# EasyEDA Pro project ProPrj_MBC5 电池 (ldo)定稿_2024-09-28.epro, board PCB4
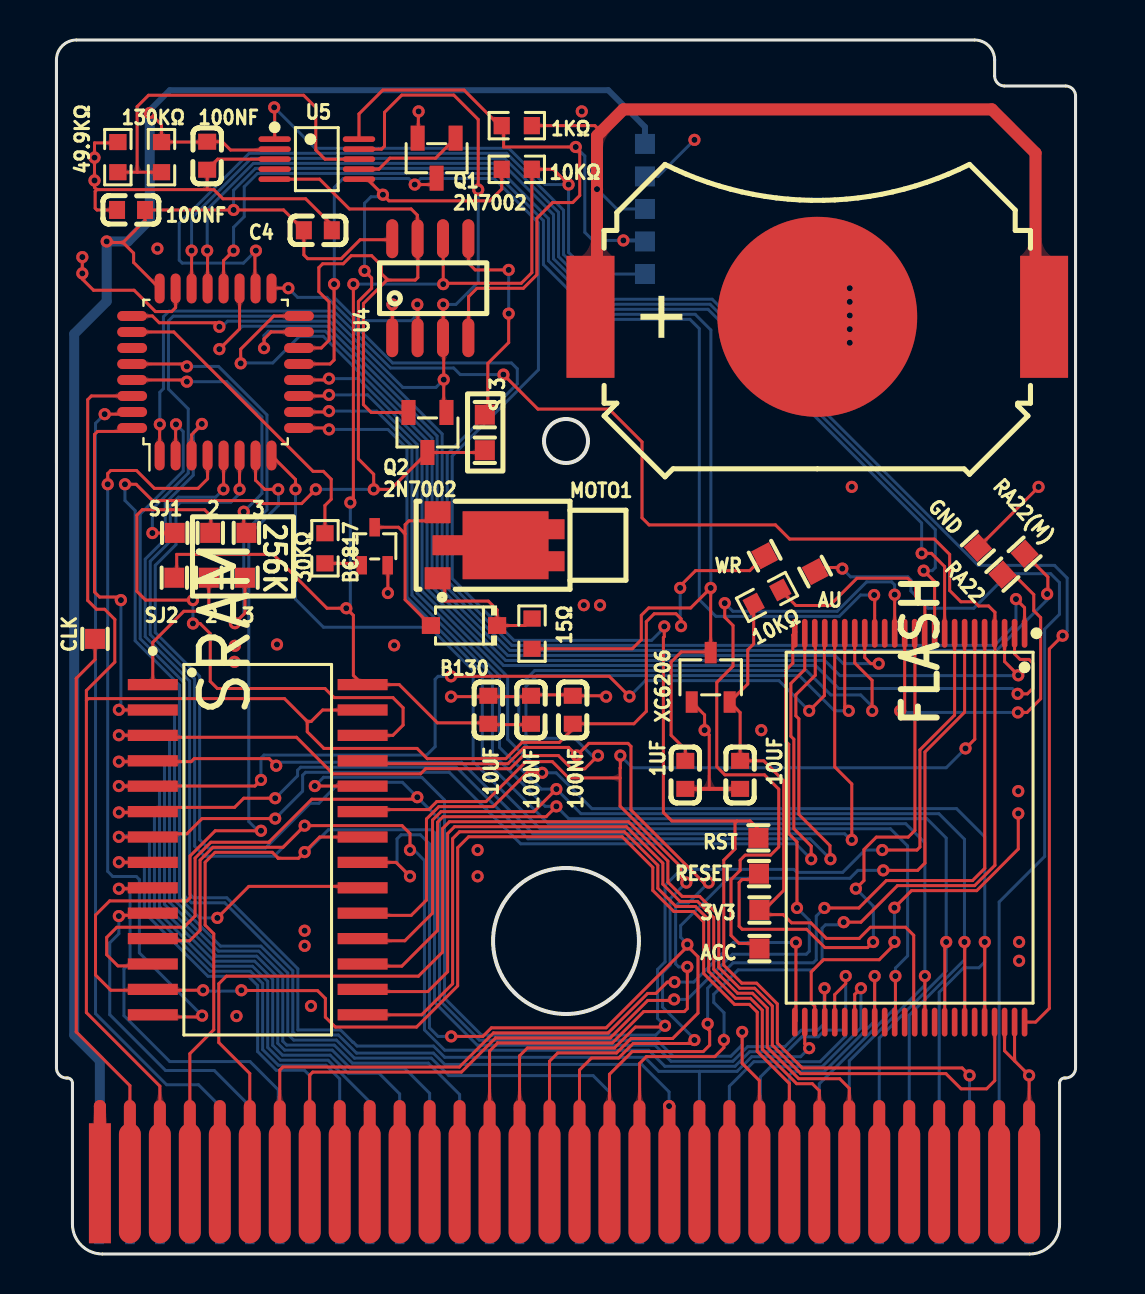
[diagram p1: board, top side]
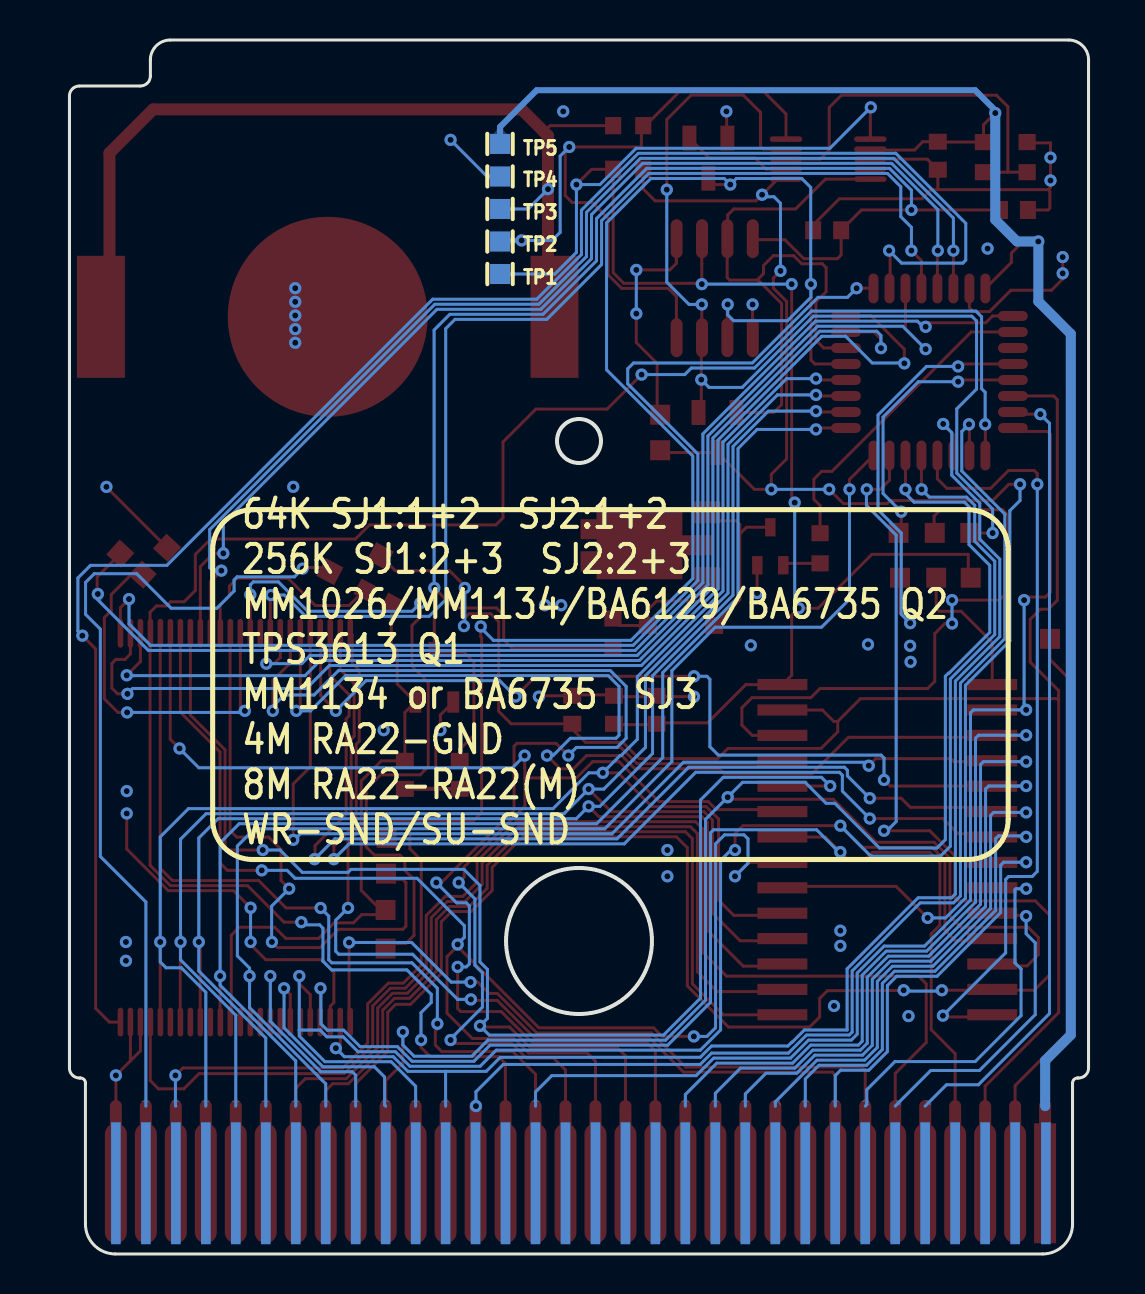
[diagram p2: board, bottom side, seen from below]

Outline 51 x 60.7 mm; copper layers: Top Layer, Bottom Layer. Coordinates in mm from the lower left corner of the outline.
Outline path: circle c25.5,40.65 r1.1 ; circle c25.5,15.65 r3.65 ; 0,59.7 0,9.3 arc(0.15,8.95) 0.5,8.8 0.55,8.8 arc(0.73,8.73) 0.8,8.55 0.8,1.5 arc(1.24,0.44) 2.3,0 48.7,0 arc(49.76,0.44) 50.2,1.5 50.2,8.55 arc(50.27,8.73) 50.45,8.8 50.5,8.8 arc(50.85,8.95) 51,9.3 51,57.9 arc(50.85,58.25) 50.5,58.4 47.45,58.4 arc(47.1,58.55) 46.95,58.9 46.95,59.7 arc(46.66,60.41) 45.95,60.7 1,60.7 arc(0.29,60.41) 0,59.7
Stack: Top Layer 0.035mm / Dielectric1 1.51mm FR4 er 4.5 / Bottom Layer 0.035mm

## Design rules (mm)
template: JLCPCB Capability(Two Layers Board)
spacing copperThickness1oz (default): track to track 0.102, other pairs 0.152 to 0.3
spacing copperThickness2oz: track to track 0.203, other pairs 0.152 to 0.3
track width copperThickness1oz (default): min 0.127, default 0.254, max 2.54
track width copperThickness2oz: min 0.203, default 0.254, max 2.54
differential pair differentialPair (default): width min 0.127, default 0.254, max 2.54; gap min 0.152, default 0.152
via viaSize (default): diameter min 0.5, default 0.61, max 10; hole min 0.3, default 0.305, max 6.3

## Placement (name value [footprint] x y rotation side)
1KΩ  -  [R0603]  23.04 56.42 0 top
1UF  -  [C0603]  31.47 23.96 90 top
2  -  [test_1p]  7.7 36.06 0 top
2#2  -  [test_1p]  7.63 33.81 0 top
3  -  [test_1p]  9.51 36.06 0 top
3#2  -  [test_1p]  9.44 33.81 0 top
3V3  RTC_VOUT  [test_1p]  35.18 17.2 270 top
10KΩ  -  [R0603]  35.56 32.85 207.8 top
10KΩ#2  -  [R0603]  23.04 54.23 0 top
10UF  -  [C0603]  21.62 27.21 90 top
10UF#2  -  [C0603]  34.21 23.96 90 top
15Ω  -  [R0603]  23.8 31.02 270 top
30KΩ  -  [R0603]  13.44 35.29 90 top
49.9KΩ  -  [R0603]  3.07 54.84 90 top
100NF  -  [C0603]  25.84 27.21 90 top
100NF#2  -  [C0603]  3.73 52.2 0 top
100NF#3  -  [C0603]  7.54 54.91 90 top
100NF#4  -  [C0603]  23.75 27.21 90 top
130KΩ  -  [R0603]  5.26 54.84 270 top
ACC  RTC_VOUT  [test_1p]  35.18 15.27 90 top
AU  RTC_VOUT  [test_1p]  37.97 34.12 27.8 top
B130  -  [SOD-123_L2.7-W1.7-LS3.8-RD]  20.4 31.42 180 top
BC817  -  [SOT-323-3_L2.1-W1.3-P1.30-LS2.3-BR]  15.93 35.39 270 top
BT1  MY-2032-12  [BAT-SMD_MY-2032-12]  38.08 46.86 180 top
C4  100nF  [C0603]  13.08 51.19 180 top
CLK  RTC_VOUT  [test_1p]  1.93 30.76 0 top
FLASH  -  [TSOP-48_L12.0-W18.4-P0.50-LS20.0-TL]  42.7 21.32 270 top
GND  Battery_Positive_After_Resistor  [test_1p]  46.11 35.31 312.4 top
MOTO1  S3070P-300070720-0002  [VIBRATING-MOTOR_S3070P-300070720-0002]  20.6 35.44 180 top
Q1
2N7002  -  [SOT-23-3_L2.9-W1.3-P1.90-LS2.4-BR]  19.02 54.79 90 top
Q2
2N7002  -  [SOT-23-3_L2.9-W1.3-P1.90-LS2.4-BR]  18.57 41.08 90 top
RA22  RTC_VOUT  [test_1p]  47.34 33.97 312.4 top
RA22(M)  RTC_VOUT  [test_1p]  48.45 35.01 312.4 top
RESET  RTC_VOUT  [test_1p]  35.16 19.02 270 top
RST  RTC_VOUT  [test_1p]  35.13 20.81 270 top
SJ1  -  [test_1p]  5.92 36.06 0 top
SJ2  -  [test_1p]  5.9 33.81 0 top
SJ3  -  [test_1p]  21.44 41.97 90 top
SJ32  RTC_VOUT  [test_1p]  21.44 40.19 270 top
SRAM  -  [SOP-28_L18.0-W8.4-P1.27-LS11.8-BL]  10.07 20.22 270 top
TP1  RTC_VOUT  [test_1p]  29.45 49 180 bottom
TP2  RTC_VOUT  [test_1p]  29.45 50.63 180 bottom
TP3  RTC_VOUT  [test_1p]  29.45 52.25 180 bottom
TP4  RTC_VOUT  [test_1p]  29.45 53.88 180 bottom
TP5  RTC_VOUT  [test_1p]  29.45 55.5 180 bottom
U2  -  [MBC5]  7.96 44.1 90 top
U4  BA6129AF  [Package_SO:SOIC-8_3.9x4.9mm_P1.27mm]  18.71 48.29 90 top
U5  TPS3613-01DGS  [MSOP-10_L3.0-W3.0-P0.50-LS5.0-BL]  13.03 54.74 270 top
U7  -  [GBGBA CARTBUS]  25.43 3.54 0 top
WR  RTC_VOUT  [test_1p]  35.44 34.92 27.8 top
XC6206  -  [SOT-23-3_L2.9-W1.6-P1.90-LS2.8-BR]  32.74 28.83 270 top

## Footprints (pads in the part's own frame, mm; a bottom-side part is the same pattern mirrored in y, then rotated)
BAT-SMD_MY-2032-12
  rect 2.4x6.1 smd: 1(-11.35,0) 1(11.35,0)
  round 10 smd: 2(0,0)
C0603
  rect 0.8x0.9 smd: 1(-0.7,0) 2(0.7,0)
GBGBA CARTBUS
  rect 1.1x6 smd: 1(-23.25,0)
  oval 1.1x6 smd: 2(-21.75,0) 3(-20.25,0) 4(-18.75,0) 5(-17.25,0) 6(-15.75,0) 7(-14.25,0) 8(-12.75,0) 9(-11.25,0) 10(-9.75,0) 11(-8.25,0) 12(-6.75,0) 13(-5.25,0) 14(-3.75,0) 15(-2.25,0) 16(-0.75,0) 17(0.75,0) 18(2.25,0) 19(3.75,0) 20(5.25,0) 21(6.75,0) 22(8.25,0) 23(9.75,0) 24(11.25,0) 25(12.75,0) 26(14.25,0) 27(15.75,0) 28(17.25,0) 29(18.75,0) 30(20.25,0) 31(21.75,0) 32(23.25,0)
MBC5
  rrect 1.5x0.5 smd: 1(-4.175,2.8) 2(-4.175,2) 3(-4.175,1.2) 4(-4.175,0.4) 5(-4.175,-0.4) 6(-4.175,-1.2) 7(-4.175,-2) 8(-4.175,-2.8) 17(4.175,-2.8) 18(4.175,-2) 19(4.175,-1.2) 20(4.175,-0.4) 21(4.175,0.4) 22(4.175,1.2) 23(4.175,2) 24(4.175,2.8)
  rrect 0.5x1.5 smd: 9(-2.8,-4.175) 10(-2,-4.175) 11(-1.2,-4.175) 12(-0.4,-4.175) 13(0.4,-4.175) 14(1.2,-4.175) 15(2,-4.175) 16(2.8,-4.175) 25(2.8,4.175) 26(2,4.175) 27(1.2,4.175) 28(0.4,4.175) 29(-0.4,4.175) 30(-1.2,4.175) 31(-2,4.175) 32(-2.8,4.175)
MSOP-10_L3.0-W3.0-P0.50-LS5.0-BL
  oval 0.28x1.62 smd: 1(-1,-2.11) 2(-0.5,-2.11) 3(0,-2.11) 4(0.5,-2.11) 5(1,-2.11) 6(1,2.11) 7(0.5,2.11) 8(0,2.11) 9(-0.5,2.11) 10(-1,2.11)
Package_SO:SOIC-8_3.9x4.9mm_P1.27mm
  rrect 1.95x0.6 smd: 1(-2.475,1.905) 2(-2.475,0.635) 3(-2.475,-0.635) 4(-2.475,-1.905) 5(2.475,-1.905) 6(2.475,-0.635) 7(2.475,0.635) 8(2.475,1.905)
R0603
  rect 0.806x0.864 smd: 1(-0.753,0) 2(0.753,0)
SOD-123_L2.7-W1.7-LS3.8-RD
  rect 0.91x0.84 smd: 1(-1.655,0) 2(1.655,0)
SOP-28_L18.0-W8.4-P1.27-LS11.8-BL
  rect 0.56x2.5 smd: 1(-8.255,-5.25) 2(-6.985,-5.25) 3(-5.715,-5.25) 4(-4.445,-5.25) 5(-3.175,-5.25) 6(-1.905,-5.25) 7(-0.635,-5.25) 8(0.635,-5.25) 9(1.905,-5.25) 10(3.175,-5.25) 11(4.445,-5.25) 12(5.715,-5.25) 13(6.985,-5.25) 14(8.255,-5.25) 15(8.255,5.25) 16(6.985,5.25) 17(5.715,5.25) 18(4.445,5.25) 19(3.175,5.25) 20(1.905,5.25) 21(0.635,5.25) 22(-0.635,5.25) 23(-1.905,5.25) 24(-3.175,5.25) 25(-4.445,5.25) 26(-5.715,5.25) 27(-6.985,5.25) 28(-8.255,5.25)
SOT-23-3_L2.9-W1.3-P1.90-LS2.4-BR
  rect 1.25x0.7 smd: 1(1,-0.95) 2(1,0.95) 3(-1,0)
SOT-23-3_L2.9-W1.6-P1.90-LS2.8-BR
  rect 1.07x0.6 smd: 1(1.235,-0.95) 2(1.235,0.95) 3(-1.235,0)
SOT-323-3_L2.1-W1.3-P1.30-LS2.3-BR
  rect 0.919x0.525 smd: 1(0.95,-0.65) 2(0.95,0.65) 3(-0.95,0)
test_1p
  rect 1x1 smd: 1(0,0)
TSOP-48_L12.0-W18.4-P0.50-LS20.0-TL
  oval 1.44x0.28 smd: 1(-9.72,5.75) 2(-9.72,5.25) 3(-9.72,4.75) 4(-9.72,4.25) 5(-9.72,3.75) 6(-9.72,3.25) 7(-9.72,2.75) 8(-9.72,2.25) 9(-9.72,1.75) 10(-9.72,1.25) 11(-9.72,0.75) 12(-9.72,0.25) 13(-9.72,-0.25) 14(-9.72,-0.75) 15(-9.72,-1.25) 16(-9.72,-1.75) 17(-9.72,-2.25) 18(-9.72,-2.75) 19(-9.72,-3.25) 20(-9.72,-3.75) 21(-9.72,-4.25) 22(-9.72,-4.75) 23(-9.72,-5.25) 24(-9.72,-5.75) 25(9.72,-5.75) 26(9.72,-5.25) 27(9.72,-4.75) 28(9.72,-4.25) 29(9.72,-3.75) 30(9.72,-3.25) 31(9.72,-2.75) 32(9.72,-2.25) 33(9.72,-1.75) 34(9.72,-1.25) 35(9.72,-0.75) 36(9.72,-0.25) 37(9.72,0.25) 38(9.72,0.75) 39(9.72,1.25) 40(9.72,1.75) 41(9.72,2.25) 42(9.72,2.75) 43(9.72,3.25) 44(9.72,3.75) 45(9.72,4.25) 46(9.72,4.75) 47(9.72,5.25) 48(9.72,5.75)
VIBRATING-MOTOR_S3070P-300070720-0002
  rect 1.3x1.1 smd: 1(1.525,1.65) 2(1.525,-1.65)
  custom 0x0 smd: 3(-1.525,0)

## Nets
3V3: 3V3.1 10KΩ.2 10UF#2.2 FLASH.37 XC6206.2
GND: 1UF.1 10UF.2 10UF#2.1 49.9KΩ.2 100NF.2 100NF#2.1 100NF#3.1 100NF#4.2 BC817.2 BT1.2 C4.1 FLASH.27 FLASH.46 FLASH.47 GND.1 Q1
2N7002.2 SRAM.14 TP4.1 U2.4 U2.23 U4.1 U5.3 U7.32 XC6206.1
VBAT: 1KΩ.1 TP2.1 U4.4 U5.10
VCC: 1UF.2 15Ω.2 100NF#2.2 100NF#3.2 130KΩ.1 C4.2 TP5.1 U2.24 U4.8 U5.2 U7.1 XC6206.3
VCC_SRAM: 10KΩ#2.2 10UF.1 100NF#4.1 SJ2.1 SRAM.28 TP1.1 U4.6 U5.1
1: SJ3.1 U4.5
/CS: U2.31 U7.5
/RD: FLASH.28 SRAM.22 U7.4
/RST: Q1
2N7002.3 RST.1 U2.13 U4.2 U7.30
/WR: 100NF.1 SRAM.27 U2.30 U7.3 WR.1
A0: FLASH.45 SRAM.10 U7.6
A1: FLASH.25 SRAM.9 U7.7
A2: FLASH.24 SRAM.8 U7.8
A3: FLASH.23 SRAM.7 U7.9
A4: FLASH.22 SRAM.6 U7.10
A5: FLASH.21 SRAM.5 U7.11
A6: FLASH.20 SRAM.4 U7.12
A7: FLASH.19 SRAM.3 U7.13
A8: FLASH.18 SRAM.25 U7.14
A9: FLASH.8 SRAM.24 U7.15
A10: FLASH.7 SRAM.21 U7.16
A11: FLASH.6 SRAM.23 U7.17
A12: FLASH.5 SRAM.2 U2.32 U7.18
A13: FLASH.4 U2.1 U7.19
A14: U2.2 U7.20
A15: FLASH.26 U2.3 U7.21
AA13: 3.1 U2.29
AA14: 3#2.1 U2.28
ACC: ACC.1 FLASH.14
AU: AU.1 U7.31
CLK: CLK.1 U7.2
CS_OUT: Q2
2N7002.1 SJ1.1 U4.3 U5.9
D0: FLASH.29 SRAM.11 U2.5 U7.22
D1: FLASH.31 SRAM.12 U2.6 U7.23
D2: FLASH.33 SRAM.13 U2.7 U7.24
D3: FLASH.35 SRAM.15 U2.8 U7.25
D4: FLASH.38 SRAM.16 U2.9 U7.26
D5: FLASH.40 SRAM.17 U2.10 U7.27
D6: FLASH.42 SRAM.18 U2.11 U7.28
D7: FLASH.44 SRAM.19 U2.12 U7.29
RA14: FLASH.3 U2.15
RA15: FLASH.2 U2.16
RA16: FLASH.1 U2.17
RA17: FLASH.48 U2.18
RA18: FLASH.17 U2.19
RA19: FLASH.16 U2.20
RA20: FLASH.9 U2.21
RA21: FLASH.10 U2.22
RA22: FLASH.13 RA22.1
RA22(M): RA22(M).1 U2.25
RAM_/CS: Q2
2N7002.2 U2.14 U4.7 U5.5
RAM_/CS_G: 10KΩ#2.1 Q2
2N7002.3 SJ32.1 SRAM.20 U5.6
RESET: FLASH.12 RESET.1
RUM: 30KΩ.2 U2.26
SEL1: 2.1 SRAM.26
SEL2: 2#2.1 SRAM.1
SND: 10KΩ.1 FLASH.11
$1N37713: 1KΩ.2 BT1.1 TP3.1
$1N45116: Q1
2N7002.1 U5.7
$1N45234: 49.9KΩ.1 130KΩ.2 U5.8
$1N46846: B130.2 BC817.3 MOTO1.2
$1N46847: 15Ω.1 B130.1 MOTO1.1
$1N46850: 30KΩ.1 BC817.1

Pads without a net: FLASH 15 30 32 34 36 39 41 43; MOTO1 3; U2 27; U5 4

## Via types
v1: diameter 0.61, hole 0.305, Top Layer to Bottom Layer, 185 vias

## Routing (per net, layer and track width the routed paths; a pad name or vN(x,y) marks a point on that pad's centre or on a via; arc(x,y) is an arc through that point)
3V3: length 31.3
  Top Layer w0.15: FLASH.37 42.9,11.64 42.9,15.93 42.5,16.34 40.73,16.34 40.17,15.78 38.53,15.78 37.75,16.56 36.79,16.56 36.38,16.97 35.41,16.97 3V3.1 35.41,17.2 36.4,18.19 36.4,23.65 35.39,24.66 10UF#2.2 34.21,27.08 XC6206.2 34.6,28.5 34.6,30.21 34.89,30.51 34.89,32.5
GND: length 125.6
  Top Layer w0.15: 16.82,45.76 16.82,47.2 16.79,47.22 ; 48.68,7.4 v1(48.68,8.93) 47.95,9.66 ; C4.1 13.78,51.45 12.47,52.76 8.33,52.76 7.88,53.22 7.54,53.22 ; v1(2.57,38.49) 2.57,39.02 2.72,39.17 4.01,39.17 4.9,38.28 7.09,38.28 7.56,38.76 U2.4 ; 49.9KΩ.2 3.03,55.55 1.91,55.55 v1(1.91,54.82) v1(1.91,53.67) 1.91,53.33 2.02,53.22 ; 27.51,27.91 100NF.2 25.79,27.96 23.75,27.96 23.66,27.87 v1(19.74,27.87) ; GND.1 49.15,38.35 49.15,38.44 ; 32.67,23.26 32.67,25.96 v1(32.44,26.19) 32.44,26.95 XC6206.1 ; FLASH.46 47.45,10.16 47.95,9.66 ; v1(1.3,49.85) 1.3,48.75 1.85,48.19 3.89,48.19 4.95,47.12 5.77,47.12 5.96,47.32 U2.23 ; v1(41.94,17.31) 42.79,18.17 46.05,18.17 48.13,20.25 v1(48.13,22.03) ; 2.02,53.22 7.54,53.22 ; 2.02,53.22 1.94,53.14 1.94,52.29 2.03,52.2 100NF#2.1 ; 7.54,53.22 100NF#3.1 8.07,54.74 U5.3 ; v1(18.12,57.13) 18.12,56.84 18.11,56.82 18.11,55.83 Q1
2N7002.2 ; 16.59,34.37 v1(16.59,33.05) ; v1(7.29,11.92) 7.22,11.85 4.93,11.85 SRAM.14 ; FLASH.27 37.95,12.39 37.77,12.57 37.77,14.1 38.38,14.71 41.17,14.71 41.94,15.48 v1(41.94,15.6) ; 47.95,9.66 FLASH.47
  Top Layer w0.2: 1UF.1 10UF#2.1
  Top Layer w0.6: U7.32 48.68,7.4
  Bottom Layer w0.15: v1(31.93,55.71) 30.1,53.88 TP4.1 ; 2.41,38.44 2.52,38.44 v1(2.57,38.49) 2.57,19.13 2.82,18.87 4,18.87 4.15,18.72 4.15,15.06 v1(7.29,11.92) ; v1(41.94,15.6) v1(41.94,17.31)
  vias: v1(1.3,49.03) v1(5.05,50.27) v1(8.93,30.41) v1(8.91,29.61) v1(9.01,11.9) v1(11.04,30.48) v1(12.42,16.17) v1(12.42,15.41) v1(12.74,12.4) v1(16.82,47.48) v1(16.9,30.43) v1(21.08,20.2) v1(21.08,18.88) v1(26.29,57.13) v1(26.39,32.44) v1(27.2,32.44) v1(27.51,27.87) v1(35.27,26.19) v1(39.7,48.29) v1(39.7,47.61) v1(39.7,46.93) v1(39.7,46.24) v1(39.7,45.56) v1(39.8,38.36) v1(48.13,23.14) v1(48.17,15.6) v1(48.17,14.66) v1(49.15,38.36)
VBAT: length 35.9
  Top Layer w0.15: 20.63,45.76 20.63,47.87 21.04,48.28 23.37,48.28 24.04,48.96 24.04,51.79 24.83,52.57 25.84,52.57 26.19,52.92 26.19,55.15 v1(25.99,55.35) 22.38,55.35 22.38,56.33 1KΩ.1 22.17,56.42 20.4,58.2 16.33,58.2 15.14,57 U5.10
  Bottom Layer w0.15: v1(28.37,50.68) 26.85,50.68 26.44,51.08 26.44,54.9 v1(25.99,55.35)
  Bottom Layer w0.2: v1(28.37,50.68) 29.4,50.68 TP2.1
VCC: length 175.6
  Top Layer w0.15: 32.71,30.1 31.27,30.1 30.76,29.6 30.76,25.94 31.47,25.23 1UF.2 ; 32.71,30.1 32.74,30.14 v1(32.74,33.3) 31.74,32.3 29.64,32.3 29.27,31.93 29.27,30.71 28.82,30.27 15Ω.2 ; 32.71,30.1 XC6206.3 ; 3.33,50.58 4.43,51.68 4.43,52.2 v1(8.86,52.2) 11.37,52.2 C4.2 12.38,49.96 12.57,49.76 14.25,49.76 15.2,50.71 16.82,50.71 ; 3.33,50.58 2.57,50.58 v1(2.52,50.63) ; 3.33,50.58 3.86,50.04 3.86,49.58 U2.24 ; U5.2 10.88,55.2 8.71,55.2 8.3,55.61 100NF#3.2 7.53,55.6 130KΩ.1 5.26,56.46 v1(4.67,57.05)
  Top Layer w0.6: U7.1 2.18,7.39 2.17,7.4
  Bottom Layer w0.15: v1(32.74,33.3) 32.75,33.31 32.75,46.2 31.96,46.98 27.3,46.98 24.62,49.66 24.62,51.77 22.11,54.28 9.96,54.28 8.86,53.19 v1(8.86,52.2)
  Bottom Layer w0.3: v1(4.67,57.05) 4.67,57.18 5.68,58.19 27.61,58.19 29.45,56.35 TP5.1
  Bottom Layer w0.5: 2.17,7.4 2.17,9.67 0.89,10.95 0.89,46 2.52,47.63 v1(2.52,50.63) 3.58,50.63 4.67,51.71 v1(4.67,57.05)
VCC_SRAM: length 85.1
  Top Layer w0.15: v1(25.63,53.47) 24.87,54.23 10KΩ#2.2 23.79,49.07 23.26,48.54 19.4,48.54 v1(19.36,48.49) 19.36,49.51 ; 21.62,26.71 21.86,26.47 23.75,26.47 23.75,26.79 ; v1(14.86,48.49) 14.86,37.72 v1(14.71,37.57) ; v1(10.9,57.33) 10.92,57.31 U5.1 ; 19.36,49.51 19.36,49.52 ; 19.36,49.51 19.36,50.71 ; 21.46,26.56 19.06,26.56 17.15,28.47 15.32,28.47 14.86,28.93 14.86,31.93 v1(14.5,32.29) 13.54,32.29 10.85,34.98 6.02,34.98 6.02,33.94 SJ2.1
  Bottom Layer w0.15: TP1.1 26.71,49 25.63,50.08 v1(25.63,53.47) 24.45,53.47 22.64,55.29 12.94,55.29 v1(10.9,57.33) ; v1(14.71,37.57) 14.71,32.49 v1(14.5,32.29) ; v1(19.36,48.49) v1(14.86,48.49)
1: length 11.1
  Top Layer w0.15: v1(22.63,49.2) 20.96,49.2 20.63,49.53 20.63,50.71 ; SJ3.1 21.59,42.12 21.59,44.53 22.63,45.57 22.63,46.92 22.53,47.02
  Bottom Layer w0.15: v1(22.63,47.02) v1(22.63,49.2)
/CS: length 43.6
  Top Layer w0.15: U2.31 3.68,41.99 v1(2.41,41.99)
  Top Layer w0.6: U7.5 8.18,7.4
  Bottom Layer w0.15: 8.18,7.4 7.11,8.46 5.51,8.46 1.96,12.02 1.96,41.53 v1(2.41,41.99)
/RD: length 65.9
  Top Layer w0.15: 11.1,19.78 10.8,20.08 7.94,20.08 7.44,19.59 7.44,16.44 7.87,16.01 7.87,11.21 6.68,10.02 6.68,7.4 ; 11.1,19.78 12.11,19.78 v1(12.42,20.1) 13.17,20.85 15.32,20.85 ; 11.1,19.78 11.09,19.78 ; 38.43,13.29 38.45,13.27 FLASH.28
  Top Layer w0.6: U7.4 6.68,7.4
  Bottom Layer w0.15: v1(38.44,13.29) 38.42,13.27 38.42,11.51 38.1,11.19 37.28,11.19 36.45,10.37 34.59,10.37 33.85,9.64 30.76,9.64 29.95,10.44 21.06,10.44 18.92,12.58 18.92,21.06 18.77,21.21 13.61,21.21 12.49,20.1 v1(12.42,20.1)
/RST: length 105.9
  Top Layer w0.15: Q1
2N7002.3 18.7,53.47 v1(17.93,53.47) ; v1(13.89,48.49) 13.89,44.7 13.69,44.5 U2.13 ; v1(45.7,8.93) 45.32,9.3 37.32,9.3 36.08,10.55 36.08,12.5 35.04,13.54 34.3,13.54 33.4,14.44 33.4,19.69 33.96,20.25 33.96,21.55 34.06,21.65 ; 34.06,21.65 34.72,21.65 35.1,21.27 ; 34.06,21.65 30.79,21.65 30.37,22.07 30.37,30.83 30.42,30.87 v1(30.42,31.38) 30.56,31.52 ; v1(18.06,47.48) 18.08,47.45 18.08,45.76
  Top Layer w0.6: U7.30 45.68,7.4
  Bottom Layer w0.15: v1(18.06,47.48) 18.06,46.96 17.77,46.66 15.06,46.66 13.89,47.83 v1(13.89,48.49) 13.9,48.5 13.9,53.33 14.35,53.78 17.62,53.78 v1(17.93,53.47) 18.23,53.78 21.9,53.78 24.12,51.56 24.12,44.21 19.8,39.9 19.8,33.77 22.9,30.68 29.78,30.68 30.33,31.23 30.33,31.29 v1(30.42,31.38) ; 45.68,7.4 45.7,7.42 v1(45.7,8.93)
/WR: length 91.9
  Top Layer w0.15: 12.55,26.63 12.55,26.11 13.39,25.28 18.05,25.28 18.56,24.77 22.49,24.77 23.3,25.58 25.17,25.58 25.84,26.25 100NF.1 28.9,26.51 29.52,27.13 29.52,31.62 29.91,32.01 31.01,32.01 31.26,31.76 v1(31.26,31.39) ; 12.55,26.63 11.41,27.77 1.59,27.77 1.5,27.68 ; 12.55,26.63 12.75,26.63 13.32,27.2 15.32,27.2 ; v1(31.21,33.3) 31.21,33.4 31.98,34.17 34.69,34.17 WR.1 ; 1.5,27.68 1.5,12.07 5.18,8.39 5.18,7.4 ; 1.5,27.68 1.5,28.17 2.92,29.6 2.92,31.73 2.41,32.24 2.01,32.24 1.57,32.68 1.57,42.72 1.75,42.9 U2.30
  Top Layer w0.6: U7.3 5.18,7.4
  Bottom Layer w0.15: v1(31.21,33.3) 31.21,31.44 v1(31.26,31.39)
A0: length 83.9
  Top Layer w0.15: 4.6,16.9 4.63,16.93 3.16,16.93 v1(3.12,16.9) ; FLASH.45 46.96,11.59 46.96,8.67 46.55,8.26 45.27,8.26 44.52,9.02 37.25,9.02 35.83,10.44 35.83,12.4 34.94,13.29 34.19,13.29 33.14,14.34 33.14,16.92 32.19,17.88 31.31,17.88 30.6,18.59 30.6,19.65 28.63,21.61 19.67,21.61 19.32,21.27 19.32,15.1 18.11,13.89 8.5,13.89 8.13,13.51 8.13,10.58 9.68,9.02 9.68,7.4
  Top Layer w0.6: U7.6 9.68,7.4
  Bottom Layer w0.15: 9.68,7.4 7.9,9.17 5.46,9.17 2.67,11.97 2.67,15.56 3.12,16.02 v1(3.12,16.9)
A1: length 57
  Top Layer w0.15: v1(3.12,18.26) 4.78,18.26 SRAM.9 ; v1(30.93,13.59) 30.57,13.59 30,13.03 29.58,13.03 27.61,11.06 21.87,11.06 20.16,9.35 11.33,9.35 11.18,9.2 11.18,7.4 ; 37.01,15.57 37.01,11.65 FLASH.25
  Top Layer w0.6: U7.7 11.18,7.4
  Bottom Layer w0.15: v1(3.12,18.26) 3.64,18.26 3.68,18.22 3.68,14.56 3.38,14.25 3.38,11.92 5.67,9.62 9.69,9.62 11.1,8.21 11.1,7.47 11.18,7.4 ; v1(37.01,15.58) 33.87,15.58 31.89,13.59 v1(30.93,13.59)
A2: length 70.2
  Top Layer w0.15: v1(30.91,12.73) 30.86,12.68 29.59,12.68 27.72,10.81 21.98,10.81 20.27,9.1 12.83,9.1 12.68,8.95 12.68,7.4 ; 37,31.1 36.85,30.95 36.85,29.54 36.5,29.19 36.5,25.63 36.65,25.48 36.65,21.01 37.06,20.6 v1(37.06,17.3) ; v1(3.12,19.59) 3.13,19.58 SRAM.8
  Top Layer w0.6: U7.8 12.68,7.4
  Bottom Layer w0.15: 12.68,7.4 12.68,8.92 12.41,9.19 11,9.19 10.07,10.12 10.07,13.42 9.61,13.89 7.58,13.89 4.4,17.07 4.4,19.44 4.25,19.59 v1(3.12,19.59) ; v1(30.91,12.73) 31.57,12.73 33.83,14.99 37.53,14.99 37.68,15.14 37.68,16.69 v1(37.06,17.3)
A3: length 75.6
  Top Layer w0.15: v1(3.12,20.86) 3.13,20.85 4.82,20.85 4.98,21.01 6.53,21.01 7.29,21.77 v1(10.95,21.77) ; FLASH.23 37.45,29.22 36.75,28.53 36.75,25.89 36.9,25.74 36.9,21.27 37.77,20.4 v1(37.77,19.74)
  Top Layer w0.6: U7.9 14.18,7.4
  Bottom Layer w0.15: v1(3.12,20.86) 3.18,20.91 4.5,20.91 4.65,20.76 4.65,17.17 7.69,14.14 9.71,14.14 10.32,13.53 10.32,10.22 11.1,9.44 13.49,9.44 14.18,8.75 14.18,7.4 ; v1(10.95,21.77) 12.32,23.14 12.32,23.94 12.47,24.09 19.66,24.09 23.24,20.51 37,20.51 v1(37.77,19.74)
A4: length 78.4
  Top Layer w0.15: v1(38.74,19.74) 38.71,19.77 38.71,20.42 37.15,21.98 37.15,26.76 37,26.91 37,27.97 37.97,28.94 37.97,31.17 ; v1(3.12,22.08) 4.78,22.08 SRAM.6 5.03,22.33 8.92,22.33 9.37,22.79 v1(10.95,22.79)
  Top Layer w0.6: U7.10 15.68,7.4
  Bottom Layer w0.15: v1(38.74,19.74) 37.72,20.76 23.59,20.76 20.02,24.34 12.22,24.34 12.07,24.19 12.07,23.91 v1(10.95,22.79) ; v1(3.12,22.08) 4.75,22.08 4.9,21.93 4.9,17.28 7.79,14.39 9.81,14.39 10.57,13.63 10.57,10.33 11.21,9.69 13.59,9.69 15.68,7.61 15.68,7.4
A5: length 76.9
  Top Layer w0.15: v1(28.68,27.87) 27.67,28.88 v1(19.74,28.88) ; 38.38,30.97 38.43,30.92 38.43,27.92 v1(37.67,27.16) ; v1(10.24,23.7) 9.93,23.4 v1(3.12,23.4) 3.13,23.39 SRAM.5
  Top Layer w0.6: U7.11 17.18,7.4
  Bottom Layer w0.15: v1(37.67,27.16) 36.16,28.67 29.47,28.67 v1(28.68,27.87) ; 17.18,7.4 17.18,8.01 16.14,9.04 14.6,9.04 13.7,9.94 11.31,9.94 10.82,10.43 10.82,13.73 9.92,14.64 7.89,14.64 5.16,17.38 5.16,23.25 5.01,23.4 v1(3.12,23.4) ; v1(19.74,28.88) 19.1,28.88 18.95,28.73 18.95,25.37 18.53,24.95 10.39,24.95 10.24,24.8 v1(10.24,23.7)
A6: length 82.2
  Top Layer w0.15: 3.07,24.62 6.74,24.62 6.89,24.77 10.64,24.77 v1(11,24.41) ; FLASH.20 38.95,24.35 39.8,23.5 v1(39.8,20.71)
  Top Layer w0.6: U7.12 18.68,7.4
  Bottom Layer w0.15: 39.7,20.76 39.45,21.01 23.85,21.01 20.27,24.59 11.15,24.59 11,24.44 v1(11,24.41) ; 18.68,7.4 18.68,8.03 17.42,9.29 14.7,9.29 13.8,10.19 11.42,10.19 11.08,10.53 11.08,13.84 10.02,14.89 8,14.89 5.41,17.48 5.41,24.47 5.26,24.62 3.07,24.62
  vias: v1(3.12,24.62)
A7: length 90.1
  Top Layer w0.15: v1(39.65,27.16) 39.45,27.36 39.45,31.47 39.4,31.53 ; 4.93,25.84 4.83,25.94 v1(3.12,25.94) ; 4.93,25.84 4.6,25.84 4.61,25.82 4.95,25.82 4.93,25.84 ; 4.93,25.84 12.01,25.84 13.84,24.01 18.22,24.01 18.48,24.26 22.71,24.26 23.36,24.92 25.12,24.92 25.78,24.26 26.44,24.26 v1(27.1,24.92)
  Top Layer w0.6: U7.13 20.18,7.4
  Bottom Layer w0.15: v1(27.1,24.92) 26.8,24.92 25.93,25.79 23.65,25.79 23.5,25.94 23.5,28.38 24.04,28.92 37.17,28.92 38.94,27.16 v1(39.65,27.16) ; 20.18,7.4 20.18,7.98 18.61,9.54 14.81,9.54 13.91,10.45 11.52,10.45 11.33,10.64 11.33,13.94 10.13,15.14 8.1,15.14 5.66,17.59 5.66,25.79 5.51,25.94 v1(3.12,25.94)
A8: length 77.1
  Top Layer w0.15: v1(31.57,14.36) 31.57,12.27 31.42,12.12 29.39,12.12 27.82,10.55 22.08,10.55 21.68,10.15 21.68,7.4 ; v1(40.82,27.16) 40.82,27.16 40.82,28.68 39.95,29.55 FLASH.18 ; 15.32,24.66 15.47,24.52 22.6,24.52 23.41,25.33 25.63,25.33 v1(26.04,24.92) 26.64,25.53 28.6,25.53 28.75,25.38 28.75,22.2 32.38,18.57 v1(32.64,18.57)
  Top Layer w0.6: U7.14 21.68,7.4
  Bottom Layer w0.15: v1(26.04,24.92) 25.63,25.33 23.6,25.33 23.14,25.79 23.14,28.38 23.94,29.17 37.53,29.17 38.75,27.95 40.25,27.95 40.82,27.38 v1(40.82,27.16) ; v1(32.64,18.57) 31.62,17.56 31.14,17.56 30.99,17.41 30.99,14.51 31.14,14.36 v1(31.57,14.36)
A9: length 78.1
  Top Layer w0.15: v1(30.45,11.41) 30.39,11.35 28.97,11.35 27.92,10.3 23.57,10.3 23.18,9.91 23.18,7.4 ; 15.32,23.39 15.31,23.4 v1(12.93,23.4) ; v1(41.33,20.2) 43.06,20.2 43.21,20.35 43.21,25.21 44.95,26.94 FLASH.8
  Top Layer w0.6: U7.15 23.18,7.4
  Bottom Layer w0.15: v1(41.33,20.2) 40.46,20.2 39.35,19.08 37.06,19.08 36.91,19.23 31.26,19.23 30.46,18.43 30.46,14.6 30.08,14.23 30.08,11.78 v1(30.45,11.41) 29.99,10.94 21.27,10.94 19.42,12.79 19.42,22.7 18.28,23.83 13.37,23.83 v1(12.93,23.4)
A10: length 76
  Top Layer w0.15: v1(17.69,18.88) 17,19.58 15.32,19.58 ; FLASH.7 45.45,27.09 43.46,25.1 43.46,19.55 43.1,19.18 v1(41.38,19.18) ; 24.68,7.4 24.68,9.64 25.09,10.05 28.03,10.05 28.76,10.78 30.84,10.78 32.11,12.04 32.11,14.87 31.6,15.38 31.6,15.39 ; 31.6,15.39 31.6,15.48 ; 31.6,15.39 27.51,11.31 21.77,11.31 21.34,10.88 v1(19.75,10.88)
  Top Layer w0.6: U7.16 24.68,7.4
  Bottom Layer w0.15: v1(41.38,19.18) 40.11,19.18 39.71,18.78 33.6,18.78 31.24,16.42 31.24,15.83 31.6,15.48 ; v1(17.69,18.88) 17.04,19.53 17.04,20.76 17.25,20.96 18.21,20.96 18.67,20.5 18.67,11.31 19.1,10.88 v1(19.75,10.88)
  vias: v1(31.57,15.48)
A11: length 67
  Top Layer w0.15: 26.18,7.4 26.18,9.2 26.78,9.8 28.13,9.8 28.86,10.53 31.76,10.53 v1(31.93,10.7) ; v1(28.22,24.92) 28.22,24.31 28.21,24.3 28.21,23.8 ; 28.21,23.8 25.63,23.8 24.82,24.62 23.5,24.62 21.5,22.62 19.03,22.62 18.63,22.22 15.43,22.22 15.32,22.12 ; 28.21,23.8 28.21,22.39 31.25,19.36 31.25,18.85 v1(31.52,18.57) 31.57,18.57 ; FLASH.6 45.96,31.03 45.96,25.74 v1(45.49,25.28)
  Top Layer w0.6: U7.17 26.18,7.4
  Bottom Layer w0.15: v1(45.49,25.28) 44.53,24.31 28.83,24.31 v1(28.22,24.92) ; v1(31.52,18.57) 30.71,17.76 30.71,14.44 30.33,14.06 30.33,12.34 31.93,10.75 v1(31.93,10.7)
A12: length 102.6
  Top Layer w0.15: v1(38.43,17.3) 40.16,17.3 41.53,18.67 45.84,18.67 46.46,19.28 46.46,31.03 FLASH.5 ; SRAM.2 3.13,27.2 v1(3.12,27.21) ; U2.32 3.62,41.13 2.06,41.13 1.91,40.98 1.91,33.1 2.16,32.85 3.07,32.85 v1(3.23,32.69) ; 27.68,7.4 27.68,8.99 28.81,10.12 32.37,10.12 32.69,10.44 32.69,11.16 32.59,11.26 v1(32.59,11.51)
  Top Layer w0.6: U7.18 27.68,7.4
  Bottom Layer w0.15: 3.23,32.85 3.23,27.31 v1(3.12,27.21) 5.76,27.21 5.91,27.06 5.91,17.69 8.21,15.39 10.23,15.39 11.58,14.05 11.58,10.99 11.87,10.7 14.01,10.7 14.91,9.79 18.76,9.79 19.64,8.92 26.86,8.92 27.68,8.1 27.68,7.4 ; v1(32.59,11.51) 32.59,13.29 33.86,14.56 37.87,14.56 38.02,14.71 38.02,16.9 v1(38.43,17.3)
A13: length 102.3
  Top Layer w0.15: v1(39.4,16.59) 40.26,16.59 42.09,18.42 45.95,18.42 46.96,19.44 46.96,32.09 46.65,32.4 46.15,32.4 45.94,32.61 45.26,32.61 44.7,33.17 44.7,34.98 43.93,35.75 36.69,35.75 35.98,36.45 29.66,36.45 29.3,36.81 29.3,40.6 27.66,42.25 24.09,42.25 v1(22.37,43.97) ; v1(5.17,41.48) 5.16,41.47 U2.1 ; 33.4,10.95 v1(33.4,10.7) 33.4,10.32 32.95,9.87 29.53,9.87 29.19,9.53 29.19,7.41 29.18,7.4
  Top Layer w0.6: U7.19 29.18,7.4
  Bottom Layer w0.15: v1(33.4,10.7) 33.41,10.7 33.41,12.06 32.89,12.58 32.89,12.98 34.11,14.2 37.87,14.2 38.31,14.64 ; v1(39.4,16.59) 39.26,16.46 38.48,16.46 38.31,16.29 38.31,14.64 ; v1(5.17,41.48) 5.17,43.09 5.35,43.27 5.35,46.86 5.64,47.14 13.87,47.14 16.72,44.3 19.88,44.3 20.21,43.97 v1(22.37,43.97) ; 38.31,14.64 38.31,14.62
A14: length 61.8
  Top Layer w0.15: v1(5.98,41.48) 5.96,41.46 U2.2
  Top Layer w0.6: U7.20 30.68,7.38 v1(30.66,7.4)
  Bottom Layer w0.15: v1(5.98,41.48) 6.34,41.12 6.34,39.15 4.19,37 4.19,30.76 6.41,28.54 6.41,17.9 6.75,17.56 8.42,17.56 11.83,14.15 11.83,11.1 11.98,10.95 14.11,10.95 15.02,10.05 18.87,10.05 19.43,9.48 29.29,9.48 30.66,8.11 30.66,7.41 ; 30.66,7.41 30.68,7.4 ; 30.66,7.41 v1(30.66,7.4)
A15: length 71.3
  Top Layer w0.15: 6.76,39.93 6.76,40.96 7.28,41.47 v1(7.28,41.5) ; FLASH.26 37.45,10.51 v1(37.67,10.29)
  Top Layer w0.6: U7.21 32.18,7.4
  Bottom Layer w0.15: 32.17,9.13 32.18,9.13 32.18,7.4 ; 32.17,9.13 30.14,9.13 29.44,9.83 19.43,9.83 18.87,10.4 15.04,10.4 14.86,10.58 14.83,10.58 14.22,11.2 12.08,11.2 12.08,14.26 8.53,17.81 6.86,17.81 6.66,18.01 6.66,28.65 4.44,30.87 4.44,34.74 5.45,35.74 5.45,37.54 6.85,38.94 6.85,41.07 v1(7.28,41.5) ; 32.17,9.13 34.06,9.13 34.8,9.87 37.24,9.87 v1(37.67,10.29)
AA13: length 13.6
  Top Layer w0.15: U2.29 6.44,43.7 v1(6.53,43.62) ; 9.42,37.17 v1(9.37,37.11) 9.37,36.19 3.1
  Bottom Layer w0.15: v1(9.37,37.11) 10.28,38.03 10.28,41.85 8.52,43.62 v1(6.53,43.62)
AA14: length 21.4
  Top Layer w0.15: 3#2.1 9.44,32.05 v1(8.93,31.54) ; v1(6.53,44.38) 6.41,44.5 U2.28
  Bottom Layer w0.15: v1(6.53,44.38) 8.11,44.38 10.54,41.95 10.54,37.21 9.38,36.05 9.38,31.99 v1(8.93,31.54)
ACC: length 34.8
  Top Layer w0.15: v1(41.95,32.97) FLASH.14 ; v1(33.44,32.54) 33.44,31.84 33.86,31.42 33.86,29.39 33.05,28.58 33.05,24.36 33.45,23.96 35.43,23.96 36.15,23.24 36.15,20.35 35.74,19.94 34.47,19.94 34.21,19.69 34.21,19.18 33.76,18.72 33.76,15.93 34.16,15.52 34.93,15.52 ACC.1
  Bottom Layer w0.15: v1(33.44,32.54) 33.85,32.13 39.07,32.13 40.54,33.61 41.8,33.61 41.95,33.46 v1(41.95,32.97)
AU: length 45.7
  Top Layer w0.15: v1(39.33,34.27) 39.27,34.32 38.17,34.32 AU.1
  Top Layer w0.6: U7.31 47.18,7.4
  Bottom Layer w0.15: v1(39.33,34.27) 39.74,33.86 42.61,33.86 42.76,33.71 42.76,33.15 43.62,32.29 45.91,32.29 47.64,34.02 49.75,34.02 50.19,33.58 50.19,31.98 49.45,31.25 49.45,19.88 47.18,17.6 47.18,7.4
CLK: length 28.7
  Top Layer w0.15: CLK.1 1.93,29.72 0.99,28.78 0.99,11.1 3.68,8.42 3.68,7.4
  Top Layer w0.6: U7.2 3.68,7.4
CS_OUT: length 52.8
  Top Layer w0.15: v1(21.11,53.22) 21.11,56.72 19.89,57.94 17.28,57.94 16.42,57.08 16.42,55.39 16.27,55.24 U5.9 ; SJ1.1 5.91,36.05 v1(4.8,36.05) ; v1(19.36,47.48) 19.36,45.76 19.38,45.74 v1(19.38,43.72) 19.38,42.21 19.52,42.08
  Bottom Layer w0.15: v1(19.38,43.72) 18.99,43.33 17.33,43.33 13.77,46.89 5.85,46.89 5.61,46.65 5.61,43.25 6.6,42.25 6.6,39.04 4.8,37.25 v1(4.8,36.05) ; v1(19.36,47.48) 19.99,47.48 21.11,48.59 v1(21.11,53.22)
D0: length 96.9
  Top Layer w0.15: 8.36,39.93 8.36,38.24 v1(8.36,38.23) ; FLASH.29 38.95,12.97 39.5,13.52 v1(39.5,13.9) ; v1(17.69,20.2) 17.69,21.02 17.3,21.42 v1(12.42,21.42) 11.34,20.34 7.83,20.34 7.19,19.69 7.19,16.19 6.67,15.66 4.93,15.66 4.82,15.77
  Top Layer w0.6: U7.22 33.68,7.4
  Bottom Layer w0.15: 39.5,11.2 38.45,11.2 38.12,10.86 37.3,10.86 36.56,10.12 34.69,10.12 33.96,9.38 30.45,9.38 29.64,10.19 19.43,10.19 18.42,11.21 18.42,19.68 17.89,20.2 17.81,20.2 ; 39.5,11.2 39.5,10.9 38.21,9.61 34.9,9.61 33.68,8.39 33.68,7.4 ; 39.5,11.2 v1(39.5,13.9) ; v1(12.42,21.42) 10.9,19.89 7.41,19.89 6.92,20.39 6.92,28.75 4.69,30.97 4.69,34.64 5.7,35.64 5.7,37.43 6.11,37.84 7.97,37.84 v1(8.36,38.23)
D1: length 106.7
  Top Layer w0.15: 10.63,20.59 10.65,20.59 ; 10.63,20.59 7.73,20.59 6.94,19.8 6.94,16.9 6.38,16.34 3.02,16.34 2.52,15.83 2.52,14.97 3.07,14.41 4.73,14.41 SRAM.12 ; 10.63,20.59 12.78,22.74 17.96,22.74 v1(18.06,22.84) ; 35.18,7.4 35.18,8.67 34.32,9.53 v1(34.32,11.1) ; U2.6 v1(9.16,38.23) ; v1(40.26,13.29) 39.95,12.98 FLASH.31
  Top Layer w0.6: U7.23 35.18,7.4
  Bottom Layer w0.15: 35.18,7.4 35.23,7.45 35.23,8.85 35.74,9.36 38.32,9.36 40.26,11.31 v1(40.26,13.29) ; 9.12,38.18 9.12,37.98 8.73,37.59 6.21,37.59 5.98,37.36 5.98,35.47 4.95,34.43 4.95,31.08 6.99,29.04 7.02,29.04 7.17,28.89 7.17,20.72 7.58,20.3 10.46,20.3 12.7,22.53 13.13,22.53 14.18,23.58 17.32,23.58 v1(18.06,22.84) 19.17,21.73 19.17,12.69 21.17,10.69 30.05,10.69 30.86,9.89 33.75,9.89 34.32,10.45 v1(34.32,11.1)
D2: length 104.2
  Top Layer w0.15: U2.7 9.96,38.69 10.42,38.23 v1(11.1,38.23) ; v1(10.24,21.16) 7.95,21.16 6.69,19.9 6.69,17.81 6.54,17.66 2.67,17.66 1.96,16.95 1.96,13.95 2.72,13.19 v1(7.34,13.19) ; FLASH.33 40.95,13.85 ; 9.25,13.15 9.28,13.18 10.82,13.18 10.83,13.17 13.07,13.17 13.46,12.78 13.46,11.85 13.96,11.35 18.02,11.35 20.08,13.41 20.08,20.32 20.62,20.86 28.32,20.86 29.84,19.33 29.84,18.18 30.9,17.12 31.88,17.12 32.39,16.61 32.39,14.02 33.93,12.48 34.68,12.48 35.07,12.09 35.07,10.13 36.68,8.53 36.68,7.4
  Top Layer w0.6: U7.24 36.68,7.4
  Bottom Layer w0.15: 36.68,7.4 36.68,8.94 36.85,9.11 38.42,9.11 40.95,11.64 v1(40.95,13.9) ; v1(7.34,13.19) 7.38,13.15 9.25,13.15 ; v1(10.24,21.16) 10.08,21.16 9.63,21.62 9.63,35.95 11.12,37.43 11.12,38.35
  vias: v1(9.25,13.19)
D3: length 107.4
  Top Layer w0.15: v1(41.99,13.9) 41.99,11.63 FLASH.35 ; 11.96,38.28 11.96,38.73 10.76,39.93 ; 15.32,11.96 18.28,11.96 19.83,13.51 19.83,20.77 20.17,21.11 28.42,21.11 30.1,19.44 30.1,18.28 31,17.38 31.98,17.38 32.64,16.71 32.64,14.13 33.98,12.79 34.73,12.79 35.32,12.19 35.32,10.23 37.04,8.51 37.83,8.51 38.18,8.17 38.18,7.4
  Top Layer w0.6: U7.25 38.18,7.4
  Bottom Layer w0.15: 38.18,7.4 38.18,8.51 41.99,12.32 v1(41.99,13.9) 41.99,14.3 42.6,14.91 42.6,20.4 41.73,21.26 24.21,21.26 20.85,24.62 20.85,29.17 18.68,31.34 13.36,31.34 11.96,32.74 v1(11.96,38.23)
D4: length 109.1
  Top Layer w0.15: 15.32,13.23 15.43,13.12 18.59,13.12 19.58,14.11 19.58,21.02 19.92,21.36 28.53,21.36 30.35,19.54 30.35,18.49 31.21,17.63 32.08,17.63 32.89,16.82 32.89,14.23 34.09,13.04 34.83,13.04 35.57,12.3 35.57,10.34 37.15,8.77 39.2,8.77 39.68,8.28 39.68,7.4 ; U2.9 13.57,41.3 v1(13.64,41.23) ; v1(43.46,13.9) 43.46,11.61 FLASH.38
  Top Layer w0.6: U7.26 39.68,7.4
  Bottom Layer w0.15: 39.68,7.4 39.68,9.66 43.46,13.44 v1(43.46,13.9) 43.46,20.56 42.5,21.51 24.62,21.51 21.31,24.82 21.31,29.07 17.54,32.84 17.54,40.27 16.59,41.23 v1(13.64,41.23)
D5: length 86.7
  Top Layer w0.15: U2.10 13.6,42.1 v1(13.64,42.14) ; 15.32,14.5 15.43,14.39 17.28,14.39 19.07,16.18 19.07,21.59 19.35,21.87 24.5,21.87 v1(25.02,22.38) ; v1(44.53,15.6) 44.46,15.53 44.46,11.6 FLASH.40
  Top Layer w0.6: U7.27 41.18,7.4
  Bottom Layer w0.15: 41.18,7.4 41.18,10.8 44.53,14.15 v1(44.53,15.6) 44.53,20.8 43.56,21.77 25.64,21.77 v1(25.02,22.38) 24.46,22.38 21.82,25.02 21.82,28.91 17.79,32.94 17.79,40.38 16.03,42.14 13.74,42.14
D6: length 86.7
  Top Layer w0.15: v1(25.02,23.25) 23.89,22.12 19.24,22.12 18.82,21.7 18.82,17.05 17.44,15.66 15.43,15.66 15.32,15.77 ; FLASH.42 45.46,11.6 45.46,15.46 45.44,15.47 ; U2.11 13.58,42.9 v1(13.64,42.96)
  Top Layer w0.6: U7.28 42.68,7.4
  Bottom Layer w0.15: 42.68,7.4 42.68,11.94 45.44,14.71 v1(45.44,15.6) 45.44,20.74 44.16,22.02 26.25,22.02 v1(25.02,23.25) 24.26,23.25 22.17,25.33 22.17,28.91 18.04,33.04 18.04,40.48 15.57,42.96 13.74,42.96
D7: length 87
  Top Layer w0.15: v1(24.31,24.06) 23.55,24.06 21.86,22.37 19.14,22.37 18.52,21.75 18.52,17.7 17.75,16.93 15.43,16.93 15.32,17.04 ; v1(13.64,43.77) 13.57,43.7 U2.12 ; 46.46,15.47 46.46,11.6 FLASH.44
  Top Layer w0.6: U7.29 44.18,7.4
  Bottom Layer w0.15: v1(13.64,43.77) 15.11,43.77 18.3,40.59 18.3,33.15 22.58,28.86 22.58,25.73 23.39,24.92 23.44,24.92 v1(24.31,24.06) 25.01,24.06 26.8,22.27 45.04,22.27 46.46,20.85 v1(46.46,15.6) 46.46,14.61 46.16,14.31 45.4,14.31 44.18,13.09 44.18,7.4
RA14: length 54.7
  Top Layer w0.15: v1(48.13,28.94) 47.45,29.62 FLASH.3 ; v1(10.39,45.29) 10.39,45.75 10.74,46.11 10.75,46.1 U2.15
  Bottom Layer w0.15: v1(10.39,45.29) 10.39,45.93 10.6,46.14 13.46,46.14 18.8,40.79 18.8,33.36 22.48,29.68 38.45,29.68 39.21,28.92 48.12,28.92 v1(48.13,28.94)
RA15: length 59.8
  Top Layer w0.15: v1(9.22,44.53) 9.22,45.24 10.88,46.9 U2.16 ; FLASH.2 47.95,30 48.22,29.73 48.67,29.73 48.88,29.53 48.88,28.3 48.59,28.01 v1(48.1,28.01)
  Bottom Layer w0.15: v1(9.22,44.53) 9.24,44.55 10.83,44.55 12.16,45.89 13.35,45.89 18.55,40.69 18.55,33.25 22.38,29.42 37.99,29.42 39.14,28.28 47.83,28.28 v1(48.1,28.01)
RA16: length 59.6
  Top Layer w0.15: FLASH.1 48.45,32.32 v1(48.02,32.75) ; 10.76,48.28 10.78,48.29 v1(11.61,48.29) 11.56,48.34 11.46,48.34
  Bottom Layer w0.15: v1(48.02,32.75) 48.02,31.51 46.94,30.43 22.79,30.43 19.55,33.67 19.55,40 23.06,43.51 23.06,44.26 22.77,44.55 16.82,44.55 13.54,47.83 12.07,47.83 v1(11.61,48.29)
RA17: length 87.3
  Top Layer w0.15: 9.98,50.12 9.93,50.07 9.93,48.31 U2.18 ; v1(50.35,30.92) 49.69,30.25 49.69,12.28 49,11.6 FLASH.48
  Bottom Layer w0.15: v1(9.98,50.17) 9.36,49.54 6.3,49.54 6.15,49.69 6.15,51.53 9.65,55.03 22.53,55.03 25.38,52.19 25.38,49.97 27.61,47.74 32.82,47.74 46.12,34.43 49.95,34.43 49.95,34.42 50.58,33.8 50.58,31.14 v1(50.35,30.92)
RA18: length 50.3
  Top Layer w0.15: FLASH.17 40.45,29.82 40.75,29.52 v1(41.15,29.52) ; U2.19 9.16,46.25 v1(8.15,45.24)
  Bottom Layer w0.15: v1(8.15,45.24) 9.3,46.39 13.56,46.39 19.05,40.9 19.05,33.46 22.58,29.93 38.96,29.93 39.37,29.52 v1(41.15,29.52)
RA19: length 58.1
  Top Layer w0.15: 8.36,48.28 8.36,49.67 v1(8.86,50.17) ; FLASH.16 40.95,32.92 v1(40.92,32.95)
  Bottom Layer w0.15: v1(40.92,32.95) 40.24,32.95 39.17,31.88 33,31.88 32.17,32.71 32.17,46.27 31.7,46.73 27.11,46.73 24.37,49.47 24.37,51.66 22.01,54.03 10.06,54.03 9.4,53.36 9.4,51.87 8.86,51.34 v1(8.86,50.17)
RA20: length 55.7
  Top Layer w0.15: U2.21 7.56,50.15 v1(7.54,50.17) ; v1(43.3,35.03) 43.79,35.03 44.45,34.37 FLASH.9
  Bottom Layer w0.15: v1(7.54,50.17) 7.54,52.22 9.85,54.53 22.31,54.53 24.87,51.97 24.87,49.76 27.4,47.24 32.61,47.24 43.3,36.54 v1(43.3,35.03)
RA21: length 56.9
  Top Layer w0.15: v1(43.4,34.17) 43.95,33.62 FLASH.10 ; 6.76,48.28 v1(6.76,50.17)
  Bottom Layer w0.15: v1(6.76,50.17) 6.76,51.8 9.75,54.78 22.43,54.78 25.13,52.08 25.13,49.87 27.51,47.49 32.71,47.49 43.98,36.22 43.98,34.32 43.83,34.17 v1(43.4,34.17)
RA22: length 18.6
  Top Layer w0.15: v1(48.11,27.08) 48.57,27.08 49.25,27.76 49.25,31.82 48.91,32.17 48.91,32.97 47.95,33.93 47.29,33.93 ; FLASH.13 42.45,27.15 42.44,27.14
  Bottom Layer w0.15: 42.22,27.14 42.28,27.08 v1(48.11,27.08)
  vias: v1(42.22,27.16)
RA22(M): length 61.1
  Top Layer w0.15: RA22(M).1 49.61,33.85 49.61,33.03 v1(49.58,33) ; v1(8.15,46.36) 7.95,46.56 5.14,46.56 4.8,46.9 U2.25
  Bottom Layer w0.15: 8.23,46.31 8.56,46.64 13.66,46.64 19.3,41 19.3,33.56 22.69,30.18 47.05,30.18 49.58,32.71 v1(49.58,33)
RAM_/CS: length 31.7
  Top Layer w0.15: 16.58,48.7 17.96,48.7 18.08,48.82 18.08,50.71 18.06,50.74 18.06,51.94 17.75,52.25 14.66,52.25 13.17,53.74 U5.5 ; 16.58,48.7 16.27,49.01 16.27,49.42 15.77,49.92 14.76,49.92 14.35,49.51 13.33,49.51 13.13,49.32 13.13,48.12 13.64,47.61 13.64,45.69 13.25,45.3 U2.14 ; 16.58,48.7 16.54,48.7 15.36,47.52 15.36,42.47 15.75,42.08 Q2
2N7002.2
RAM_/CS_G: length 76.4
  Top Layer w0.15: 15.32,18.31 15.25,18.38 9.63,18.38 v1(8.05,16.81) ; 10KΩ#2.1 22.29,53.25 21.69,52.66 16.64,52.66 16.34,52.96 15.56,53.74 U5.6 ; v1(12.98,38.23) 12.27,37.52 10.08,37.52 9.93,37.67 4.8,37.67 3.99,38.49 v1(3.43,38.49) ; v1(15.42,49.15) 15.77,48.8 15.77,48.29 15.11,47.63 15.11,39.75 15.88,38.99 v1(15.88,38.23) 16.72,38.23 Q2
2N7002.3 21.33,40.08 SJ32.1
  Bottom Layer w0.15: v1(8.05,16.81) 7.15,16.81 6.16,17.8 6.16,28.44 3.94,30.66 3.94,37.17 3.43,37.67 3.43,38.38 ; v1(12.98,38.23) v1(15.88,38.23) ; v1(15.42,49.15) 15.42,52.54 15.74,52.86 16.24,52.86 v1(16.34,52.96)
RESET: length 28.6
  Top Layer w0.15: FLASH.12 42.96,31.02 42.96,21.18 42.63,20.84 41.03,20.84 40.41,20.23 40.41,18.67 v1(40.01,18.27) ; RESET.1 34.87,18.72 34.31,18.72 34.16,18.57 34.16,16.39 34.32,16.24 37.54,16.24 38.46,15.32 40.59,15.32 v1(40.87,15.6)
  Bottom Layer w0.15: v1(40.87,15.6) 40.88,15.61 40.88,17.39 v1(40.01,18.27)
RUM: length 15.8
  Top Layer w0.15: 30KΩ.2 13.44,37.42 13.75,37.74 13.75,38.74 13.36,39.13 12.84,39.13 5.87,46.1 U2.26
SEL1: length 29.7
  Top Layer w0.15: v1(6.83,31.53) 7.19,31.53 7.7,31.02 7.7,28.63 8.05,28.28 13.44,28.28 13.89,27.82 16.84,27.82 17.35,27.31 17.35,26.45 16.83,25.93 15.32,25.93 ; 6.93,32.49 6.73,32.69 4.46,32.69 4.03,33.13 4.03,36.94 4.3,37.22 7.41,37.22 7.73,36.9 7.73,36.09 2.1
  Bottom Layer w0.15: v1(6.83,31.53) v1(6.83,32.69)
SEL2: length 7.2
  Top Layer w0.15: SRAM.1 4.82,30.58 6.38,32.14 7.48,32.14 7.63,32.29 2#2.1
SND: length 10.4
  Top Layer w0.15: FLASH.11 43.46,31.04 43.46,32.44 43.15,32.75 43.14,32.75 42.99,32.9 42.99,33.4 42.6,33.79 40.06,33.79 38.7,32.42 37,32.42 10KΩ.1
$1N37713: length 47.3
  Top Layer w0.15: 1KΩ.2 26.94,56.42 27.25,56.11
  Top Layer w0.6: BT1.1 49,47.29 49,55.05 46.81,57.23 28.37,57.23 27.25,56.11 27.05,55.91 v1(27.05,53.24) 27.05,47.19 BT1.1
  Bottom Layer w0.15: TP3.1 28.04,52.25 v1(27.05,53.24)
$1N45116: length 5.5
  Top Layer w0.15: U5.7 16.14,54.24 16.69,54.79 18.98,54.79 Q1
2N7002.1
$1N45234: length 19.4
  Top Layer w0.15: U5.8 13.44,54.74 12.98,55.2 12.98,57.33 12.37,57.94 4.61,57.94 4.04,57.37 4.04,54.11 4.06,54.09 ; 4.06,54.09 130KΩ.2 ; 4.06,54.09 49.9KΩ.1
$1N46846: length 9.1
  Top Layer w0.15: B130.2 17.45,32.72 17.45,36 ; MOTO1.2 18.64,36.66 17.64,36.66 17.45,36.47 17.45,36 ; 17.45,36 17.12,36.34 BC817.3
$1N46847: length 6.8
  Top Layer w0.15: 15Ω.1 23.45,31.42 B130.1 22.05,32.21 21.62,32.64 19.43,32.64 19.43,33.43 MOTO1.1
$1N46850: length 1.9
  Top Layer w0.15: 15.27,34.37 15.11,34.53 30KΩ.1

## Copper pours and planes (outline as drawn; the poured copper is in the pictures)
GND on Top Layer: -21.8,62.22 60.22,62.22 60.22,8.1 -21.8,8.1
GND on Bottom Layer: -3.07,62.93 55.67,62.93 55.67,7.92 -3.07,7.92

Small or netless copper shapes (teardrops, artwork), in the pictures only: 454 on Top Layer, 175 on Bottom Layer

## Text on the board
Bottom Silkscreen Layer: 64K SJ1:1+2  SJ2:1+2 / 256K SJ1:2+3  SJ2:2+3 / MM1026/MM1134/BA6129/BA6735 Q2 / TPS3613 Q1 / MM1134 or BA6735  SJ3 / 4M RA22-GND / 8M RA22-RA22(M) / WR-SND/SU-SND
Top Solder Mask Layer: @Nintendo | MBC5 SRAM (ldo)
Top Silkscreen Layer: 256K
